# Altium schematic sheet wireless.SchDoc
size A
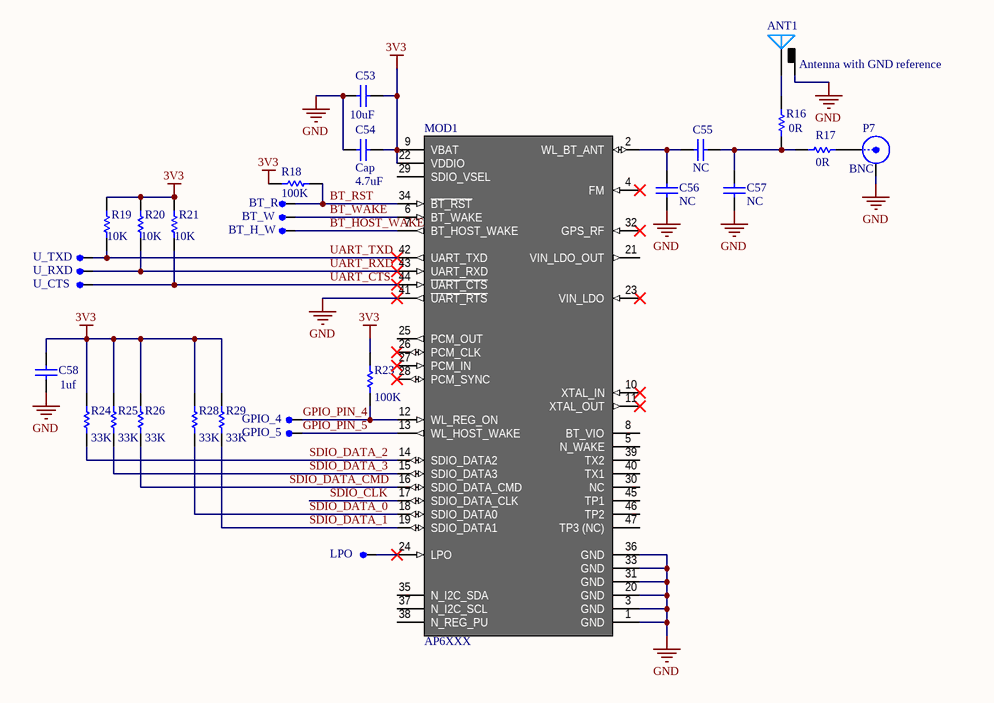
[diagram p0: wireless.SchDoc]

## Parts
ANT1  Antenna with GND reference  [AN043]  (net tie, no BOM)
BT_H_W  TESTPOINT  [TESTPOINT200]  (value not drawn)  (no BOM)
BT_R  TESTPOINT  [TESTPOINT200]  (value not drawn)  (no BOM)
BT_W  TESTPOINT  [TESTPOINT200]  (value not drawn)  (no BOM)
C53  value 10uF  [CAPC1608N]  (hidden comment: Cap)
C54  Cap  value 4.7uF  [CAPC1608N]
C55  value NC  [capc1005n]  (hidden comment: Cap)
C56  value NC  [capc1005n]  (hidden comment: Cap)
C57  value NC  [capc1005n]  (hidden comment: Cap)
C58  value 1uf  [CAPC1005N]  (hidden comment: Cap)
GPIO_4  TESTPOINT  [TESTPOINT200]  (value not drawn)  (no BOM)
GPIO_5  TESTPOINT  [TESTPOINT200]  (value not drawn)  (no BOM)
LPO  TESTPOINT  [TESTPOINT200]  (value not drawn)  (no BOM)
MOD1  AP6XXX  [AP1212_44N]
P7  BNC  [MCB3-V4]
R16  value 0R  [resc1005n]  (hidden comment: Res1)
R17  value 0R  [resc1005n]  (hidden comment: Res1)
R18  value 100K  [RESC1005N]  (hidden comment: Res1)
R19  value 10K  [RESC1005N]  (hidden comment: Res1)
R20  value 10K  [RESC1005N]  (hidden comment: Res1)
R21  value 10K  [RESC1005N]  (hidden comment: Res1)
R23  value 100K  [RESC1005N]  (hidden comment: Res1)
R24  value 33K  [RESC1005N]  (hidden comment: Res1)
R25  value 33K  [RESC1005N]  (hidden comment: Res1)
R26  value 33K  [RESC1005N]  (hidden comment: Res1)
R28  value 33K  [RESC1005N]  (hidden comment: Res1)
R29  value 33K  [RESC1005N]  (hidden comment: Res1)
U_CTS  TESTPOINT  [TESTPOINT200]  (value not drawn)  (no BOM)
U_RXD  TESTPOINT  [TESTPOINT200]  (value not drawn)  (no BOM)
U_TXD  TESTPOINT  [TESTPOINT200]  (value not drawn)  (no BOM)

## Nets
3V3: C53.1 C54.2 C58.2 MOD1.9(VBAT) MOD1.22(VDDIO) R18.2 R19.1 R20.1 R21.1 R23.2 R24.2 R25.2 R26.2 R28.2 R29.2
GND: ANT1.2(GND) C53.2 C54.1 C56.2 C57.2 C58.1 MOD1.1(GND) MOD1.3(GND) MOD1.20(GND) MOD1.31(GND) MOD1.33(GND) MOD1.36(GND) MOD1.41(~{UART_RTS}) P7.2(Y)
BT_HOST_WAKE: BT_H_W.1(TP) MOD1.7(BT_HOST_WAKE)
BT_RST: BT_R.1(TP) MOD1.34(~{BT_RST}) R18.1
BT_WAKE: BT_W.1(TP) MOD1.6(BT_WAKE)
GPIO_PIN_4: GPIO_4.1(TP) MOD1.12(WL_REG_ON) R23.1
GPIO_PIN_5: GPIO_5.1(TP) MOD1.13(WL_HOST_WAKE)
SDIO_CLK: MOD1.17(SDIO_DATA_CLK)
SDIO_DATA_0: MOD1.18(SDIO_DATA0) R28.1
SDIO_DATA_1: MOD1.19(SDIO_DATA1) R29.1
SDIO_DATA_2: MOD1.14(SDIO_DATA2) R24.1
SDIO_DATA_3: MOD1.15(SDIO_DATA3) R25.1
SDIO_DATA_CMD: MOD1.16(SDIO_DATA_CMD) R26.1
UART_CTS: MOD1.44(~{UART_CTS}) R21.2 U_CTS.1(TP)
UART_RXD: MOD1.43(UART_RXD) R20.2 U_RXD.1(TP)
UART_TXD: MOD1.42(UART_TXD) R19.2 U_TXD.1(TP)
NetANT1_1: ANT1.1(A) R16.2
NetC55_1: C55.1 C56.1 MOD1.2(WL_BT_ANT)
NetC55_2: C55.2 C57.1 R16.1 R17.2
NetLPO_1: LPO.1(TP) MOD1.24(LPO)
NetP7_1: P7.1(X) R17.1

Not connected (* = marked no-connect by the designer): MOD1 4(FM)* 5(N_WAKE) 8(BT_VIO) 10(XTAL_IN)* 11(XTAL_OUT)* 21(VIN_LDO_OUT) 23(VIN_LDO)* 25(PCM_OUT) 26(PCM_CLK)* 27(PCM_IN)* 28(PCM_SYNC)* 29(SDIO_VSEL) 30(NC) 32(GPS_RF)* 35(N_I2C_SDA) 37(N_I2C_SCL) 38(N_REG_PU) 39(TX2) 40(TX1) 45(TP1) 46(TP2) 47(TP3_(NC))

## Library data of the parts
ANT1 = Antenna_TwoPort: Generic Antenna; Published: 24-Mar-1999; LatestRevisionDate: 17-Jul-2002; LatestRevisionNote: Re-released for DXP Platform.; PackageReference: PIN1; Publisher: Altium Limited
C53-C58 = Cap: Capacitor; Published: 8-Jun-2000; LatestRevisionDate: 17-Jul-2002; LatestRevisionNote: Re-released for DXP Platform.; PackageReference: RAD-0.3; Publisher: Altium Limited; PackageDescription: Radial Cap, Thru-Hole; 2 Leads; 0.3 in Pin Spacing
MOD1 = AP6XXX: 802.11 + BT + FM + GPS module
P7 = BNC: BNC Elbow Connector; LatestRevisionDate: 17-Jul-2002; LatestRevisionNote: Re-released for DXP Platform.; Publisher: Altium Limited
R16-R21 R23-R26 R28 R29 = Res1: Resistor; Published: 8-Jun-2000; LatestRevisionDate: 17-Jul-2002; LatestRevisionNote: Re-released for DXP Platform.; PackageReference: AXIAL-0.3; Publisher: Altium Limited; PackageDescription: Axial Device, Thru-Hole; 2 Leads; 0.3 in Pin Spacing
BT_H_W BT_R BT_W GPIO_4 GPIO_5 LPO U_CTS U_RXD U_TXD = TESTPOINT: LatestRevisionDate: 17-Jul-2002; LatestRevisionNote: Re-released for DXP Platform.; Publisher: Altium Limited